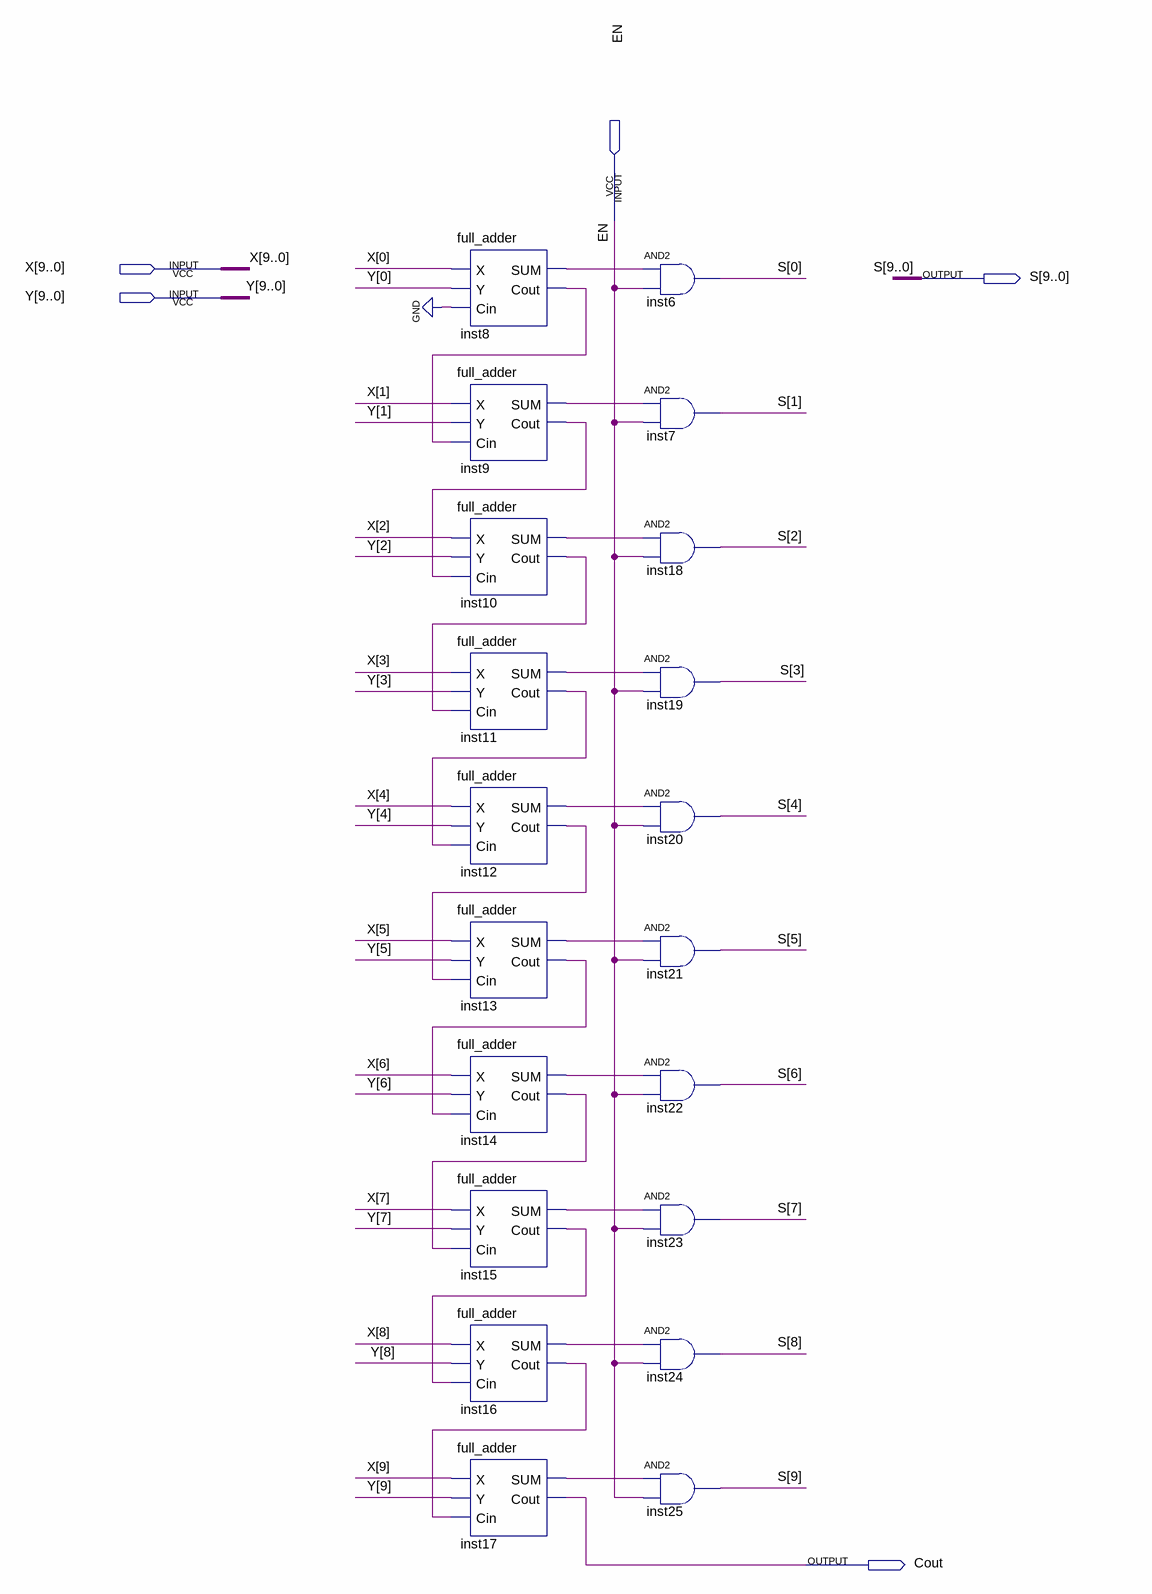
[diagram p0: schematic sheet]
// Quartus schematic ten_bit_adder.bdf as structural Verilog: 20 symbols, 5 pins
module ten_bit_adder (
  input  EN,
  input  [9:0] X,
  input  [9:0] Y,
  output [9:0] S,
  output Cout
);

  wire inst8_cout, inst8_sum, inst9_cout, inst9_sum, inst10_cout, inst10_sum, inst11_cout, inst11_sum,
       inst12_cout, inst12_sum, inst13_cout, inst13_sum, inst14_cout, inst14_sum, inst15_cout, inst15_sum,
       inst16_cout, inst16_sum, inst17_sum;

  full_adder inst8 (.X(X[0]), .Y(Y[0]), .Cin(1'b0), .SUM(inst8_sum), .Cout(inst8_cout));
  full_adder inst9 (.X(X[1]), .Y(Y[1]), .Cin(inst8_cout), .SUM(inst9_sum), .Cout(inst9_cout));
  full_adder inst10 (.X(X[2]), .Y(Y[2]), .Cin(inst9_cout), .SUM(inst10_sum), .Cout(inst10_cout));
  full_adder inst11 (.X(X[3]), .Y(Y[3]), .Cin(inst10_cout), .SUM(inst11_sum), .Cout(inst11_cout));
  full_adder inst12 (.X(X[4]), .Y(Y[4]), .Cin(inst11_cout), .SUM(inst12_sum), .Cout(inst12_cout));
  full_adder inst13 (.X(X[5]), .Y(Y[5]), .Cin(inst12_cout), .SUM(inst13_sum), .Cout(inst13_cout));
  full_adder inst14 (.X(X[6]), .Y(Y[6]), .Cin(inst13_cout), .SUM(inst14_sum), .Cout(inst14_cout));
  full_adder inst15 (.X(X[7]), .Y(Y[7]), .Cin(inst14_cout), .SUM(inst15_sum), .Cout(inst15_cout));
  full_adder inst16 (.X(X[8]), .Y(Y[8]), .Cin(inst15_cout), .SUM(inst16_sum), .Cout(inst16_cout));
  full_adder inst17 (.X(X[9]), .Y(Y[9]), .Cin(inst16_cout), .SUM(inst17_sum), .Cout(Cout));
  and inst6 (S[0], inst8_sum, EN);
  and inst7 (S[1], inst9_sum, EN);
  and inst18 (S[2], inst10_sum, EN);
  and inst19 (S[3], inst11_sum, EN);
  and inst20 (S[4], inst12_sum, EN);
  and inst21 (S[5], inst13_sum, EN);
  and inst22 (S[6], inst14_sum, EN);
  and inst23 (S[7], inst15_sum, EN);
  and inst24 (S[8], inst16_sum, EN);
  and inst25 (S[9], inst17_sum, EN);
endmodule
